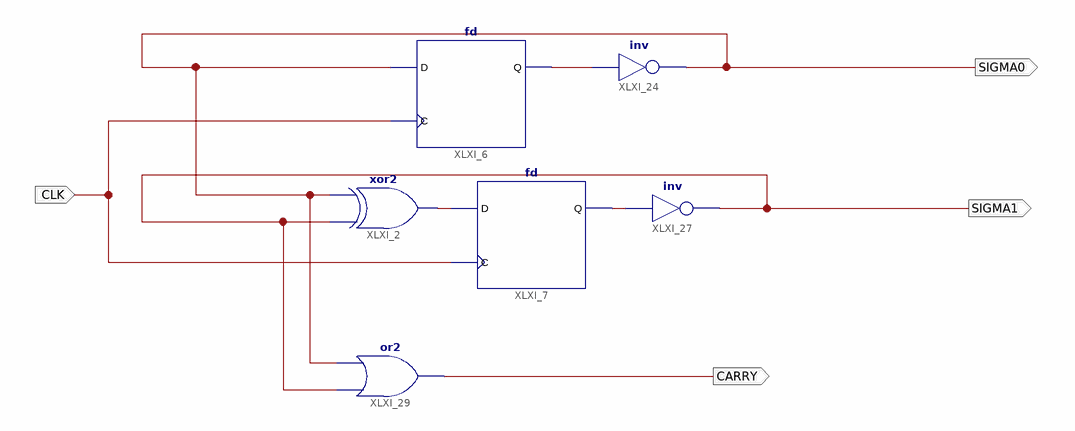
[diagram p0: schematic sheet 1]
// Xilinx ISE schematic CNT2_正論理.sch (spartan6) as structural Verilog: 6 symbols, 4 ports
module \CNT2_正論理  (
  input  CLK,
  output SIGMA0,
  output SIGMA1,
  output CARRY
);

  wire XLXN_18, XLXN_58, XLXN_66;

  xor XLXI_2 (XLXN_18, SIGMA1, SIGMA0);
  fd XLXI_6 (.C(CLK), .D(SIGMA0), .Q(XLXN_58));
  fd XLXI_7 (.C(CLK), .D(XLXN_18), .Q(XLXN_66));
  not XLXI_24 (SIGMA0, XLXN_58);
  not XLXI_27 (SIGMA1, XLXN_66);
  or XLXI_29 (CARRY, SIGMA1, SIGMA0);
endmodule
